# Altium schematic sheet _gyroscope.SchDoc
size Tabloid
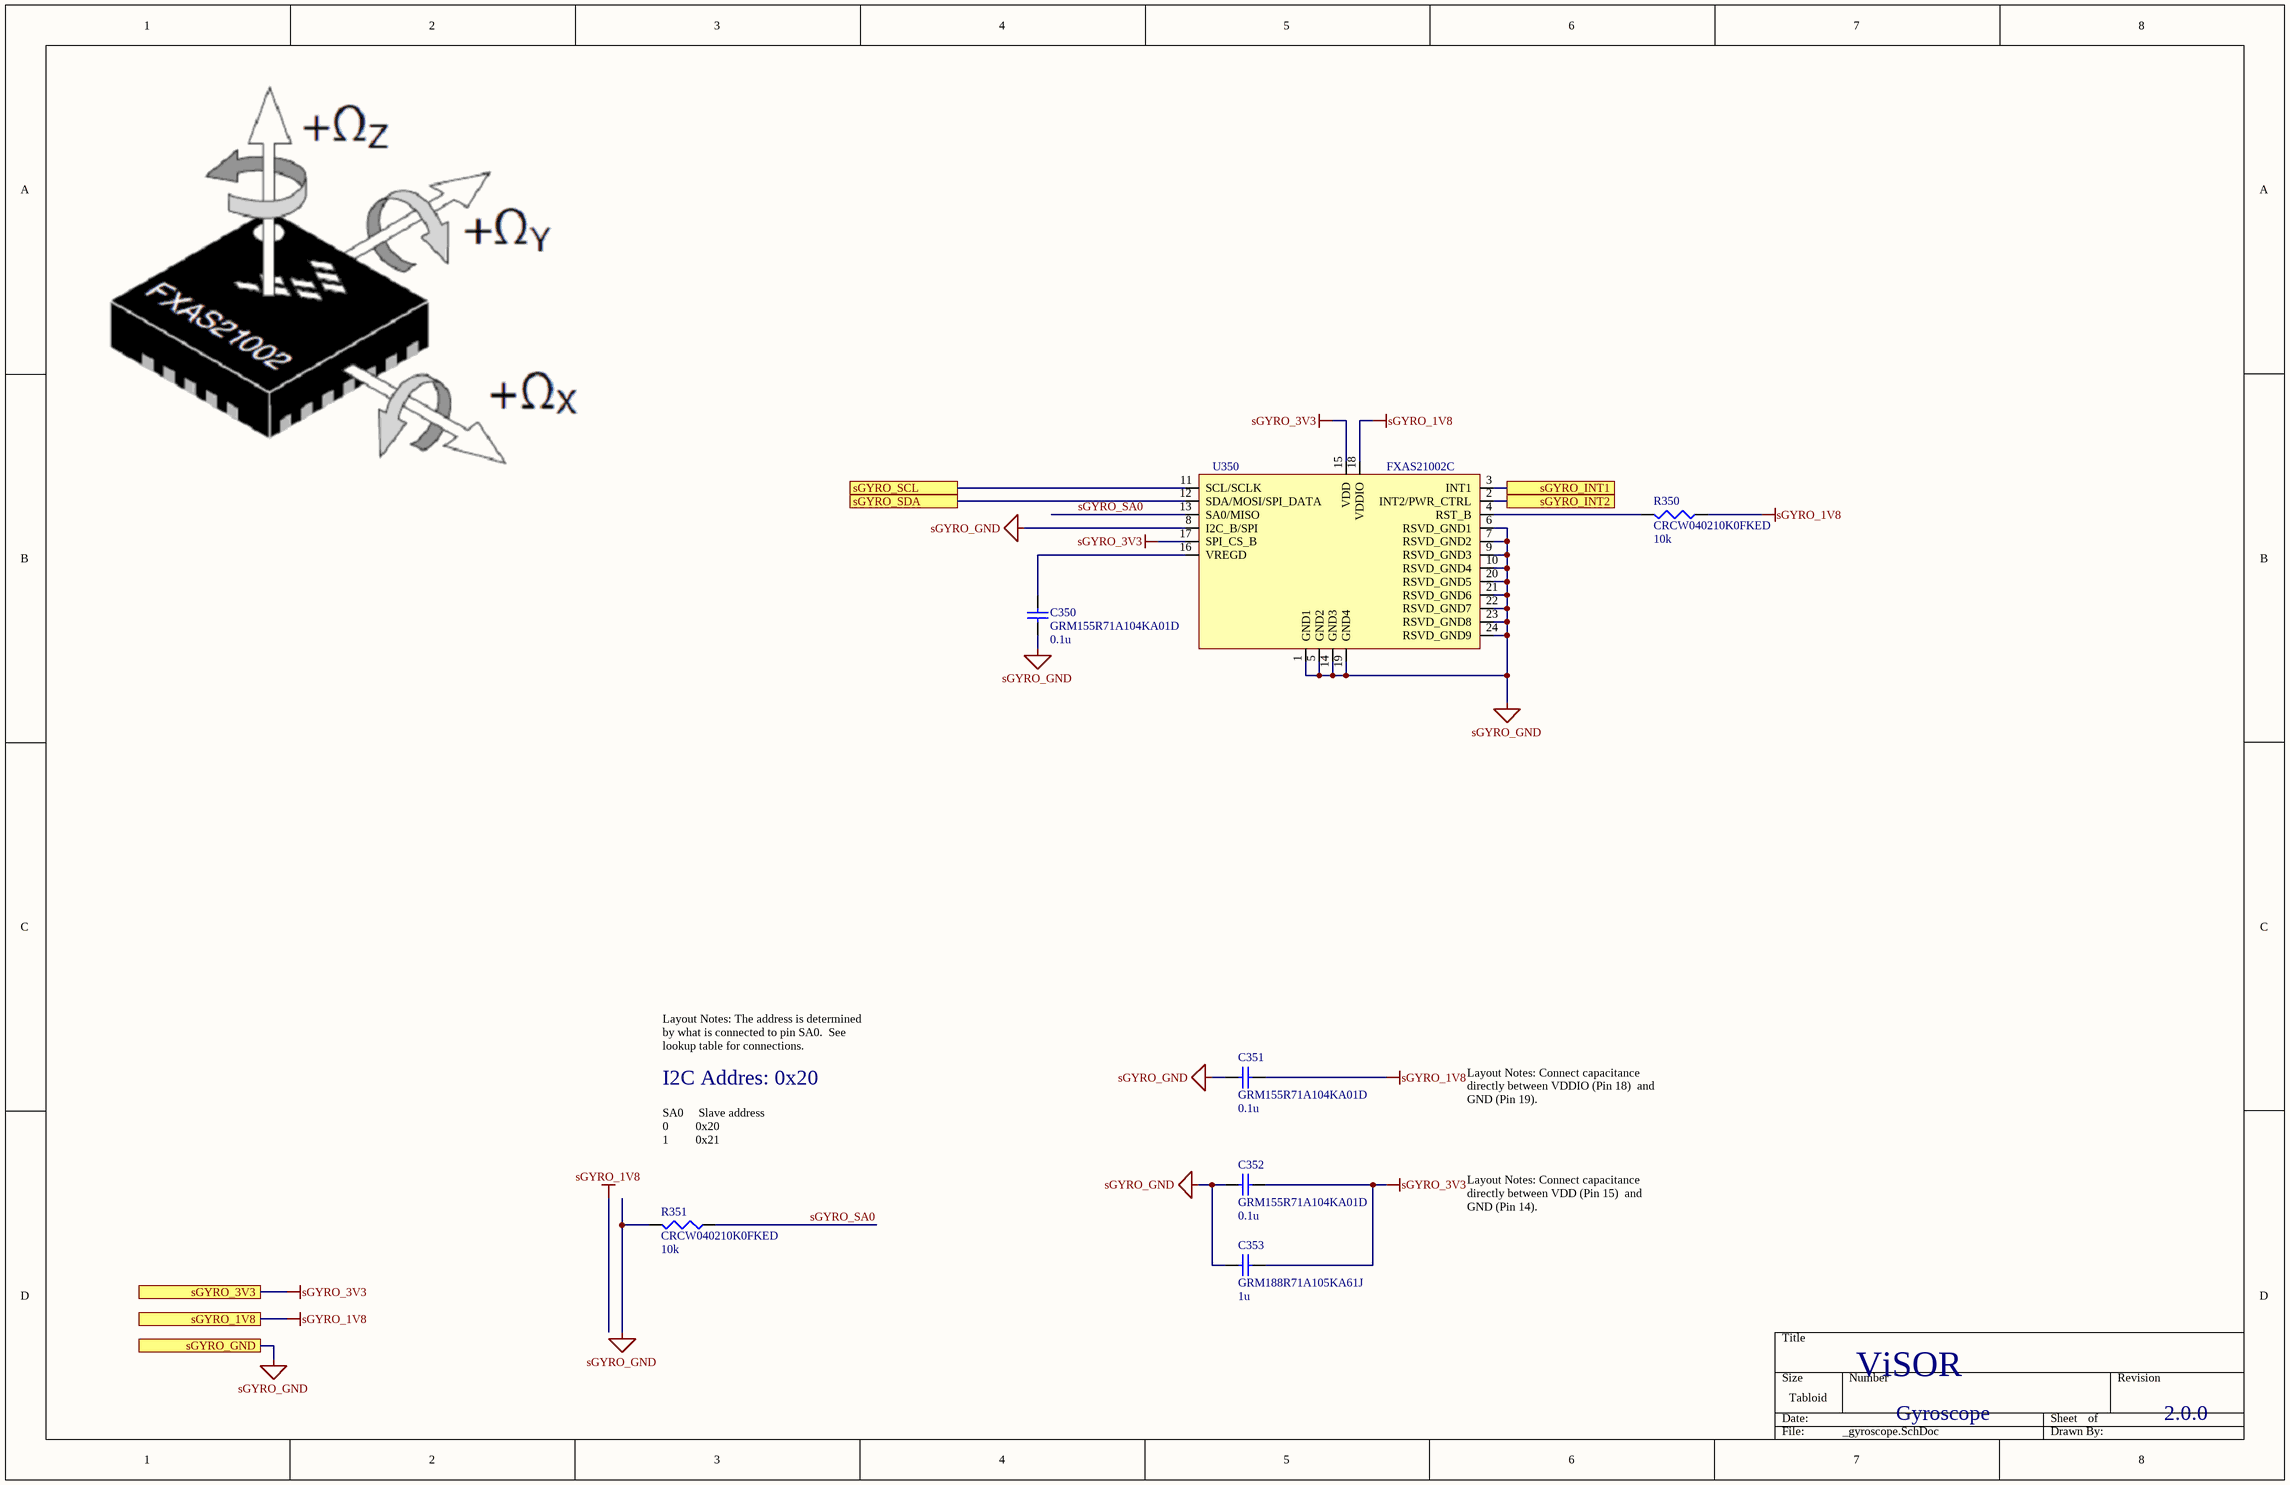
[diagram p0: _gyroscope.SchDoc]

## Parts
C350  GRM155R71A104KA01D  value 0.1u  [0402]
C351  GRM155R71A104KA01D  value 0.1u  [0402]
C352  GRM155R71A104KA01D  value 0.1u  [0402]
C353  GRM188R71A105KA61J  value 1u  [0603]
R350  CRCW040210K0FKED  value 10k  [0402]
R351  CRCW040210K0FKED  value 10k  [0402]
U350  FXAS21002C  [SMD QFN 24_4X4MM 7/5]

## Ports
sGYRO_1V8, sGYRO_3V3, sGYRO_GND, sGYRO_INT1, sGYRO_INT2, sGYRO_SCL, sGYRO_SDA

## Nets
sGYRO_1V8: C351.2 R350.1 U350.18(VDDIO) ; port sGYRO_1V8
sGYRO_3V3: C352.2 C353.1 U350.15(VDD) U350.17(SPI_CS_B) ; port sGYRO_3V3
sGYRO_GND: C350.2 C351.1 C352.1 C353.2 R351.2 U350.1(GND1) U350.5(GND2) U350.6(RSVD_GND1) U350.7(RSVD_GND2) U350.8(I2C_B/SPI) U350.9(RSVD_GND3) U350.10(RSVD_GND4) U350.14(GND3) U350.19(GND4) U350.20(RSVD_GND5) U350.21(RSVD_GND6) U350.22(RSVD_GND7) U350.23(RSVD_GND8) U350.24(RSVD_GND9) ; port sGYRO_GND
sGYRO_INT1: U350.3(INT1) ; port sGYRO_INT1
sGYRO_INT2: U350.2(INT2/PWR_CTRL) ; port sGYRO_INT2
sGYRO_SA0: R351.1 U350.13(SA0/MISO)
sGYRO_SCL: U350.11(SCL/SCLK) ; port sGYRO_SCL
sGYRO_SDA: U350.12(SDA/MOSI/SPI_DATA) ; port sGYRO_SDA
NetC350_1: C350.1 U350.16(VREGD)
NetR350_2: R350.2 U350.4(RST_B)

## Notes on the sheet
- I2C Addres: 0x20
- Layout Notes: The address is determined by what is connected to pin SA0.  See lookup table for connections.
- Layout Notes: Connect capacitance directly between VDDIO (Pin 18)  and GND (Pin 19).
- SA0     Slave address
  0         0x20
  1         0x21
- Layout Notes: Connect capacitance directly between VDD (Pin 15)  and GND (Pin 14).
- ViSOR
- Gyroscope
- 2.0.0

## Library data of the parts
C350-C352 = GRM155R71AxxxKdddd: -55-125C, 1005, 10V, X7R, ±10%
C353 = GRM188R71AxxxKdddd: -55-125C, 1608, 10V, X7R, ±10%
R350 R351 = CRCW0402xxxxFKED: 0.125W, -55-155C, 1005, 50V, ±1%
U350 = FXAS21002C: 3-Axis Digital Angular Rate  Gyroscope